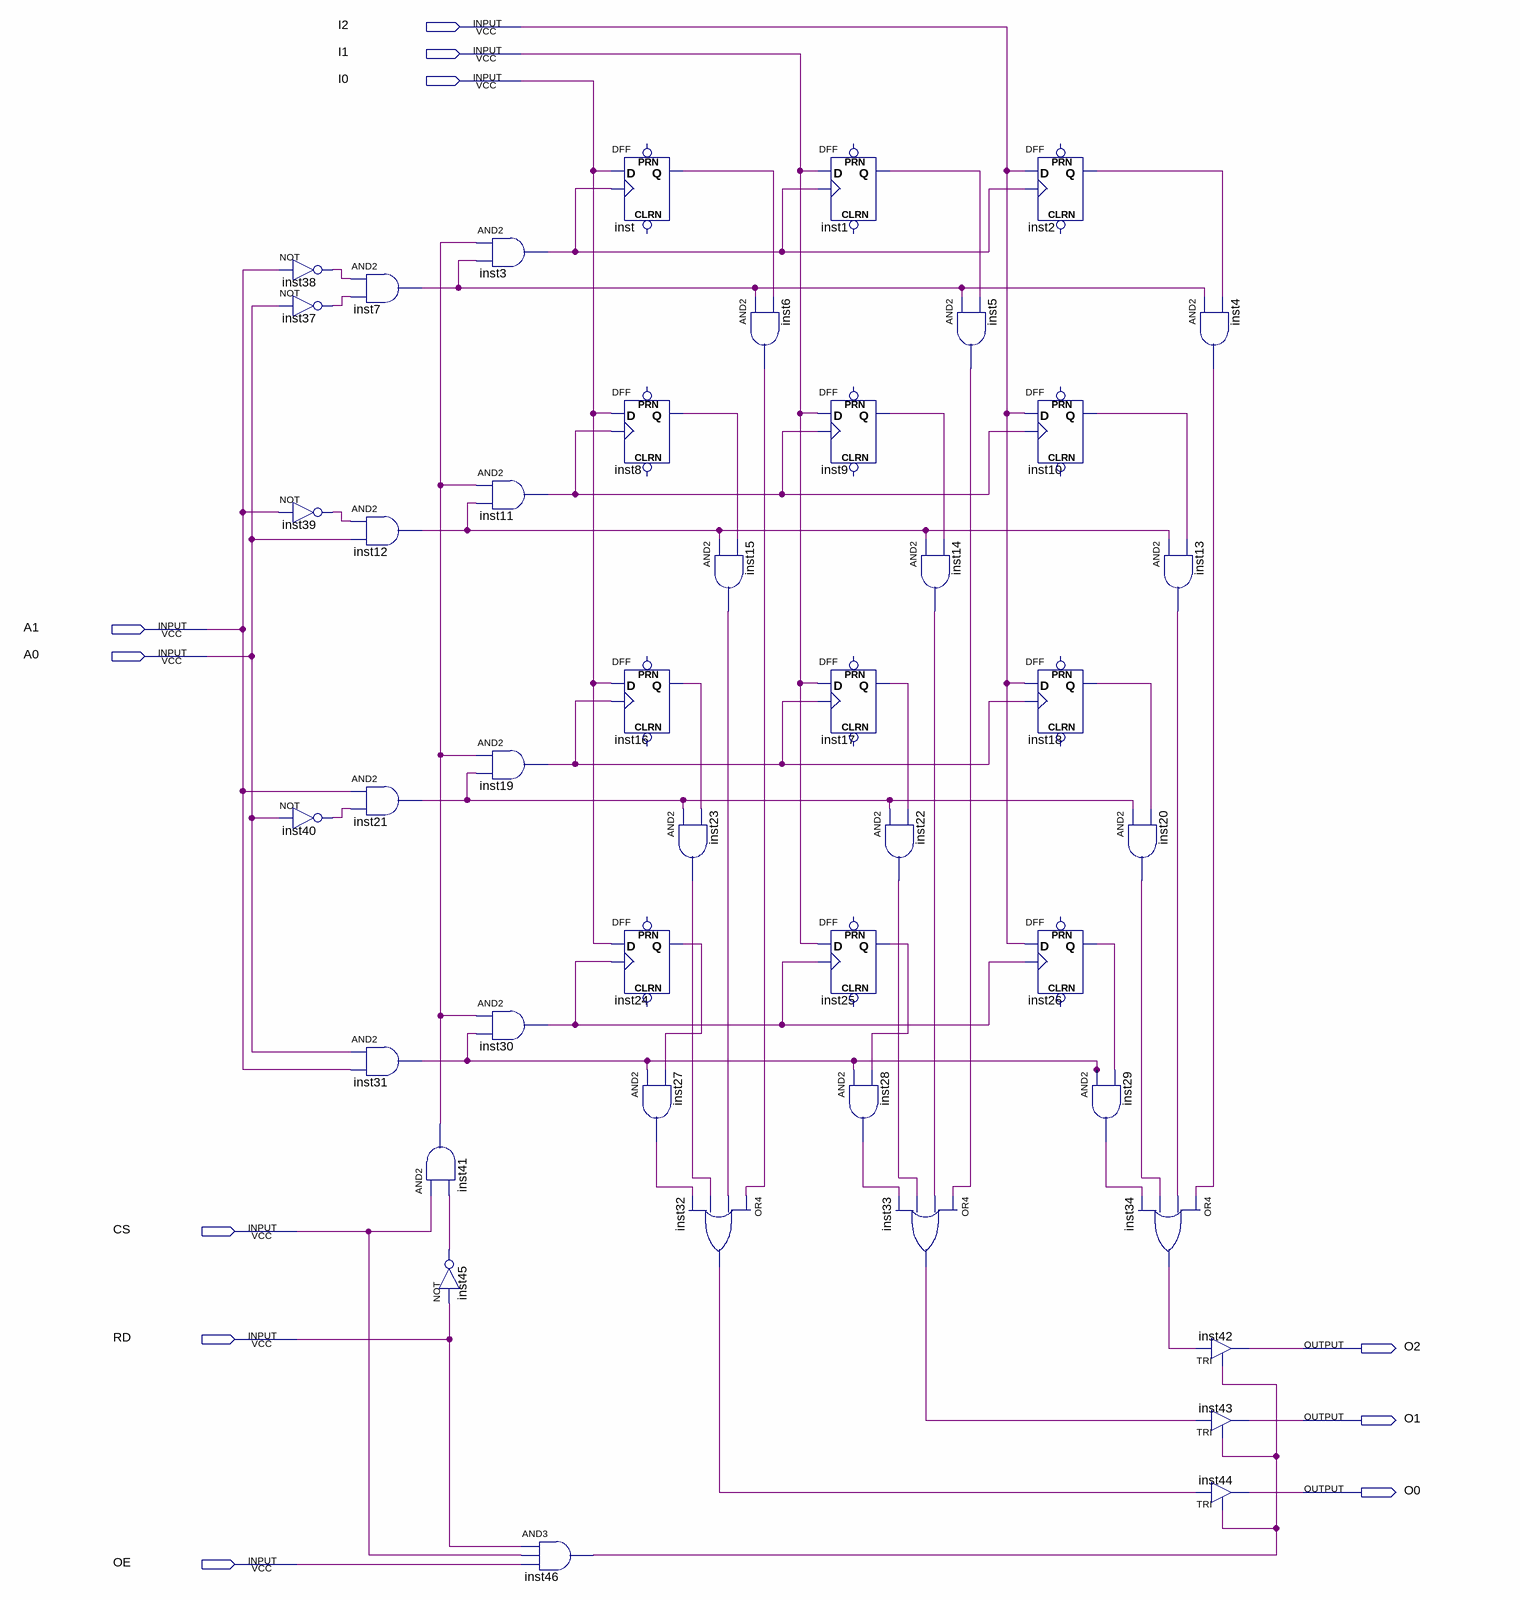
[diagram p0: schematic sheet]
// Quartus schematic mem_4x3.bdf as structural Verilog: 45 symbols, 11 pins
module mem_4x3 (
  input  I2,
  input  I1,
  input  I0,
  input  A1,
  input  A0,
  input  CS,
  input  RD,
  input  OE,
  output O2,
  output O1,
  output O0
);

  wire inst1_q, inst2_q, inst3_out, inst4_out, inst5_out, inst6_out, inst7_out, inst8_q, inst9_q, inst10_q,
       inst11_out, inst12_out, inst13_out, inst14_out, inst15_out, inst16_q, inst17_q, inst18_q, inst19_out,
       inst20_out, inst21_out, inst22_out, inst23_out, inst24_q, inst25_q, inst26_q, inst27_out, inst28_out,
       inst29_out, inst30_out, inst31_out, inst32_out, inst33_out, inst34_out, inst37_out, inst38_out,
       inst39_out, inst40_out, inst41_out, inst45_out, inst46_out, inst_q;

  not inst38 (inst38_out, A1);
  not inst37 (inst37_out, A0);
  not inst39 (inst39_out, A1);
  not inst40 (inst40_out, A0);
  and inst7 (inst7_out, inst38_out, inst37_out);
  and inst12 (inst12_out, inst39_out, A0);
  and inst21 (inst21_out, A1, inst40_out);
  and inst31 (inst31_out, A0, A1);
  and inst41 (inst41_out, CS, inst45_out);
  and inst3 (inst3_out, inst41_out, inst7_out);
  and inst11 (inst11_out, inst41_out, inst12_out);
  and inst19 (inst19_out, inst41_out, inst21_out);
  and inst30 (inst30_out, inst41_out, inst31_out);
  not inst45 (inst45_out, RD);
  and inst46 (inst46_out, RD, CS, OE);
  DFF inst (.CLK(inst3_out), .D(I0), .Q(inst_q));  // open: CLRN, PRN
  DFF inst8 (.CLK(inst11_out), .D(I0), .Q(inst8_q));  // open: CLRN, PRN
  DFF inst16 (.CLK(inst19_out), .D(I0), .Q(inst16_q));  // open: CLRN, PRN
  DFF inst24 (.CLK(inst30_out), .D(I0), .Q(inst24_q));  // open: CLRN, PRN
  and inst27 (inst27_out, inst31_out, inst24_q);
  and inst15 (inst15_out, inst12_out, inst8_q);
  and inst23 (inst23_out, inst21_out, inst16_q);
  or inst32 (inst32_out, inst6_out, inst15_out, inst23_out, inst27_out);
  and inst6 (inst6_out, inst7_out, inst_q);
  DFF inst1 (.CLK(inst3_out), .D(I1), .Q(inst1_q));  // open: CLRN, PRN
  DFF inst9 (.CLK(inst11_out), .D(I1), .Q(inst9_q));  // open: CLRN, PRN
  DFF inst17 (.CLK(inst19_out), .D(I1), .Q(inst17_q));  // open: CLRN, PRN
  DFF inst25 (.CLK(inst30_out), .D(I1), .Q(inst25_q));  // open: CLRN, PRN
  and inst28 (inst28_out, inst31_out, inst25_q);
  and inst14 (inst14_out, inst12_out, inst9_q);
  and inst22 (inst22_out, inst21_out, inst17_q);
  or inst33 (inst33_out, inst5_out, inst14_out, inst22_out, inst28_out);
  and inst5 (inst5_out, inst7_out, inst1_q);
  DFF inst2 (.CLK(inst3_out), .D(I2), .Q(inst2_q));  // open: CLRN, PRN
  DFF inst10 (.CLK(inst11_out), .D(I2), .Q(inst10_q));  // open: CLRN, PRN
  DFF inst18 (.CLK(inst19_out), .D(I2), .Q(inst18_q));  // open: CLRN, PRN
  DFF inst26 (.CLK(inst30_out), .D(I2), .Q(inst26_q));  // open: CLRN, PRN
  and inst20 (inst20_out, inst21_out, inst18_q);
  and inst29 (inst29_out, inst31_out, inst26_q);
  or inst34 (inst34_out, inst4_out, inst13_out, inst20_out, inst29_out);
  and inst4 (inst4_out, inst7_out, inst2_q);
  and inst13 (inst13_out, inst12_out, inst10_q);
  TRI inst42 (.IN(inst34_out), .OE(inst46_out), .OUT(O2));
  TRI inst43 (.IN(inst33_out), .OE(inst46_out), .OUT(O1));
  TRI inst44 (.IN(inst32_out), .OE(inst46_out), .OUT(O0));
endmodule
